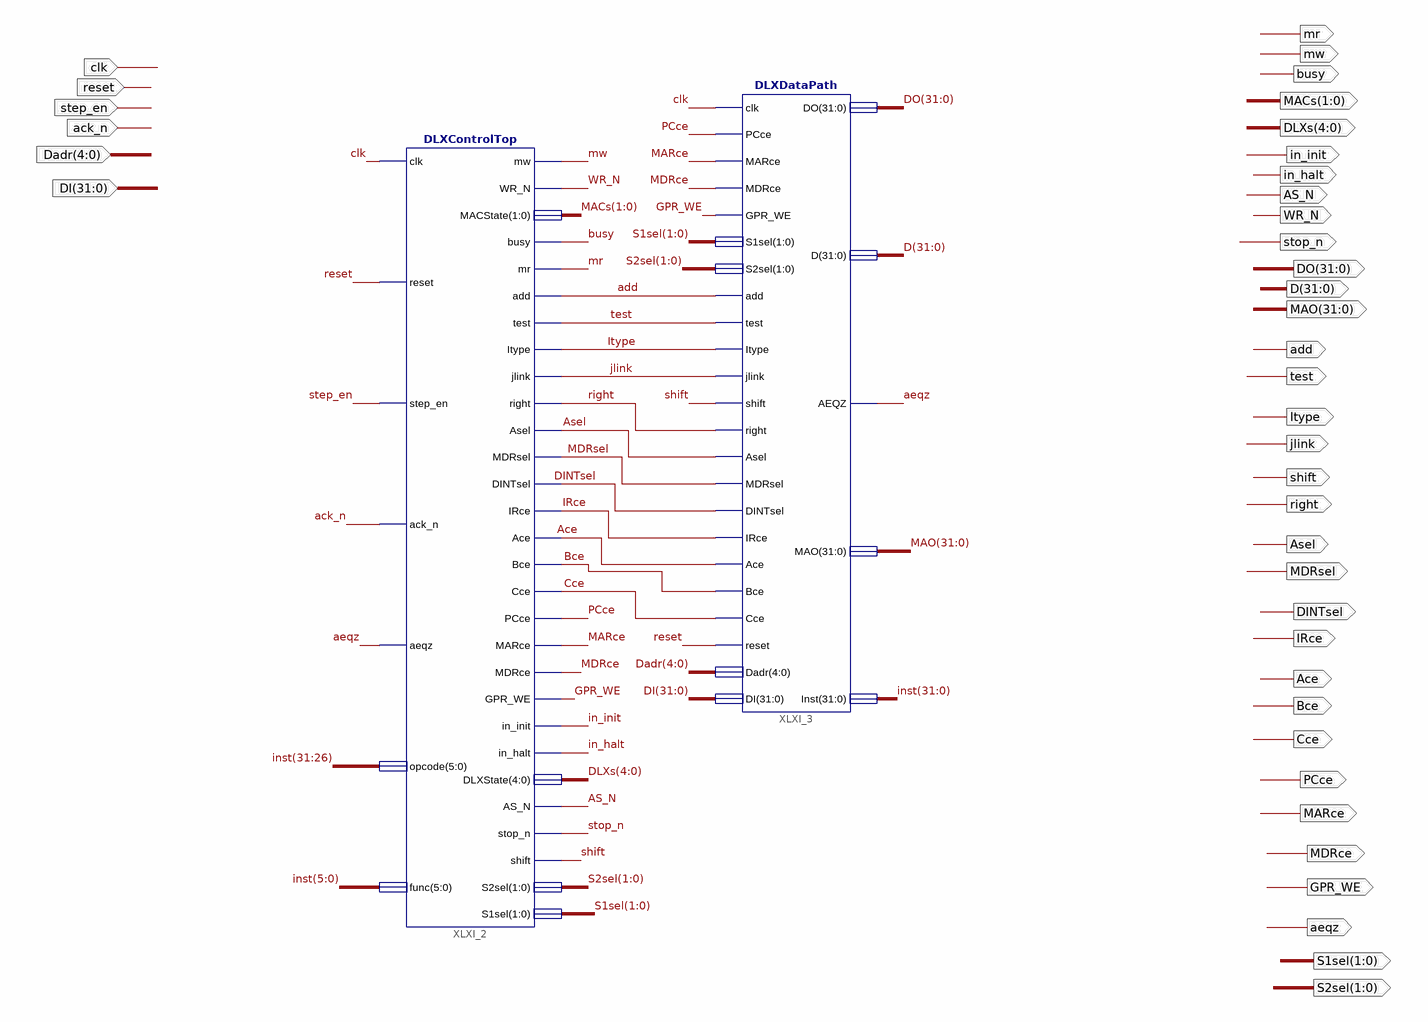
[diagram p0: schematic sheet 1]
// Xilinx ISE schematic DLX_Top.sch (spartan6) as structural Verilog: 2 symbols, 39 ports
module DLX_Top (
  input  reset,
  input  clk,
  input  step_en,
  input  ack_n,
  input  [4:0] Dadr,
  input  [31:0] DI,
  output aeqz,
  output mw,
  output WR_N,
  output busy,
  output mr,
  output Asel,
  output MDRsel,
  output jlink,
  output DINTsel,
  output Ace,
  output Cce,
  output PCce,
  output MARce,
  output Bce,
  output MDRce,
  output GPR_WE,
  output in_init,
  output [4:0] DLXs,
  output AS_N,
  output stop_n,
  output in_halt,
  output shift,
  output [1:0] S1sel,
  output [31:0] MAO,
  output [31:0] D,
  output [31:0] DO,
  output [1:0] S2sel,
  output [1:0] MACs,
  output add,
  output test,
  output Itype,
  output right,
  output IRce
);

  wire [31:0] inst;

  DLXControlTop XLXI_2 (
    .clk(clk), .reset(reset), .step_en(step_en), .ack_n(ack_n), .aeqz(aeqz), .opcode(inst[31:26]),
    .func(inst[5:0]), .mw(mw), .WR_N(WR_N), .MACState(MACs), .busy(busy), .mr(mr), .add(add), .test(test),
    .Itype(Itype), .jlink(jlink), .right(right), .Asel(Asel), .MDRsel(MDRsel), .DINTsel(DINTsel),
    .IRce(IRce), .Ace(Ace), .Bce(Bce), .Cce(Cce), .PCce(PCce), .MARce(MARce), .MDRce(MDRce), .GPR_WE(GPR_WE),
    .in_init(in_init), .in_halt(in_halt), .DLXState(DLXs), .AS_N(AS_N), .stop_n(stop_n), .shift(shift),
    .S2sel(S2sel), .S1sel(S1sel));
  DLXDataPath XLXI_3 (
    .clk(clk), .PCce(PCce), .MARce(MARce), .MDRce(MDRce), .GPR_WE(GPR_WE), .S1sel(S1sel), .S2sel(S2sel),
    .add(add), .test(test), .Itype(Itype), .jlink(jlink), .shift(shift), .right(right), .Asel(Asel),
    .MDRsel(MDRsel), .DINTsel(DINTsel), .IRce(IRce), .Ace(Ace), .Bce(Bce), .Cce(Cce), .reset(reset),
    .Dadr(Dadr), .DI(DI), .DO(DO), .D(D), .AEQZ(aeqz), .MAO(MAO), .Inst(inst));
endmodule
